# Altium schematic sheet drvinput2.SchDoc
size A4
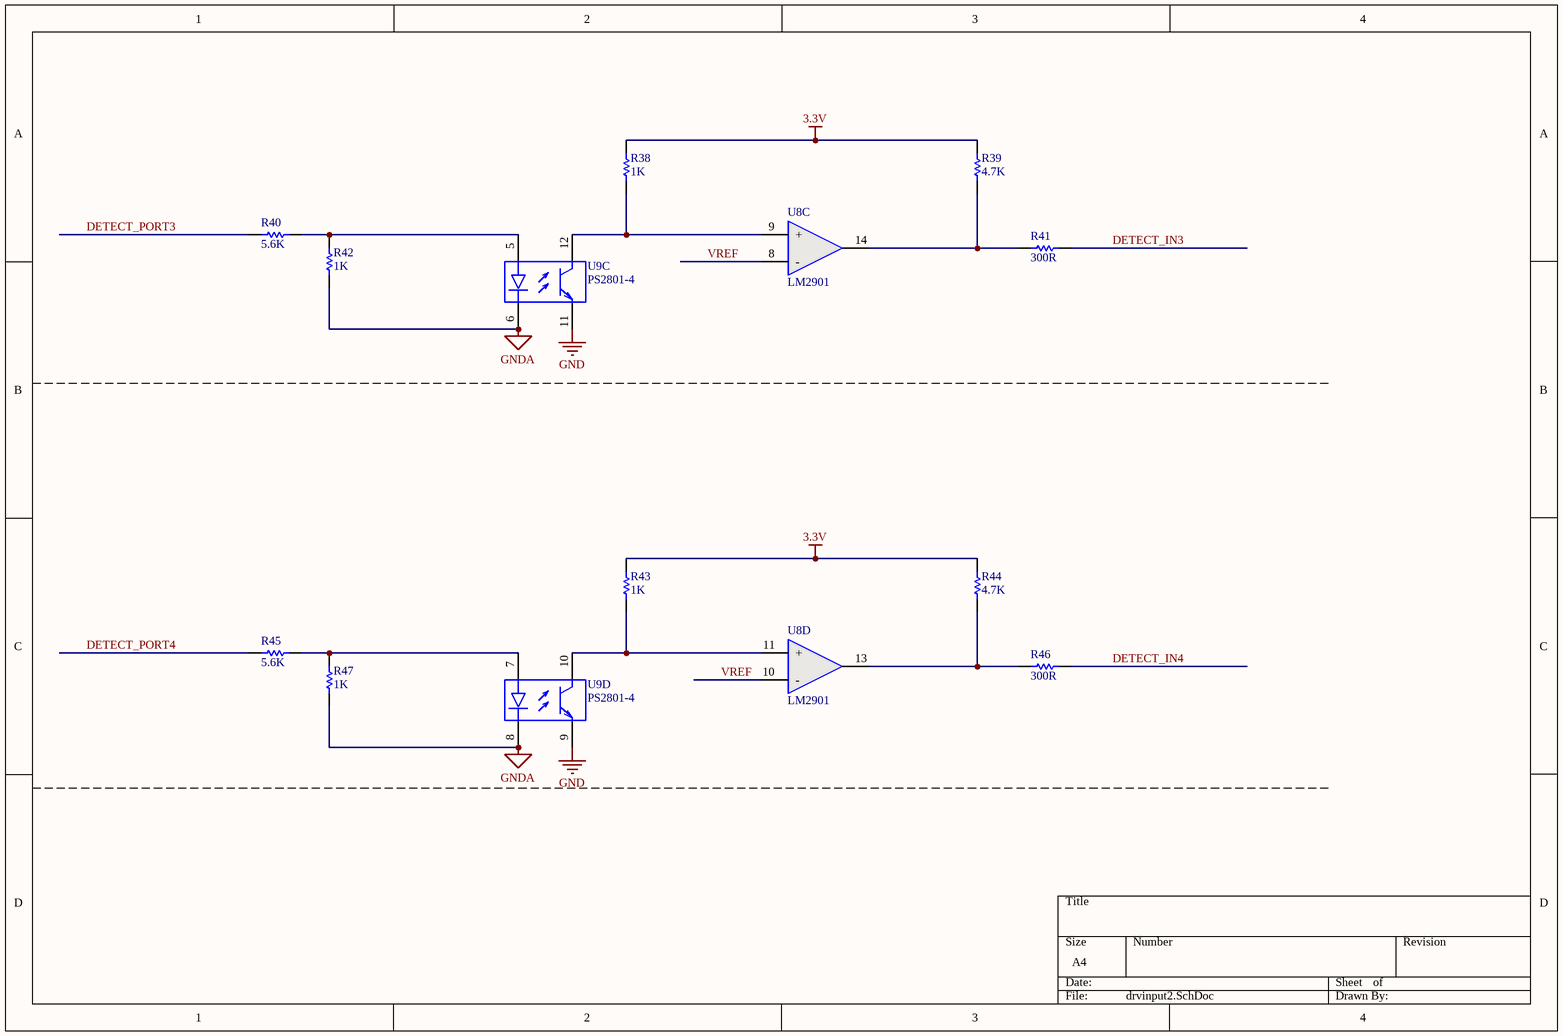
[diagram p0: drvinput2.SchDoc]

## Parts
R38  1K  [RESC2012M]
R39  4.7K  [RESC2012M]
R40  5.6K  [RESC2012M]
R41  300R  [RESC2012M]
R42  1K  [RESC2012M]
R43  1K  [RESC2012M]
R44  4.7K  [RESC2012M]
R45  5.6K  [RESC2012M]
R46  300R  [RESC2012M]
R47  1K  [RESC2012M]
U8  LM2901  [SOIC-14AM]  (parts C,D of 4)
U9  PS2801-4  [SOIC16_N]  (parts C,D of 4)

## Nets
3.3V: R38.1 R39.2 R43.1 R44.2
GND: U9.9(E) U9.11(E)
GNDA: R42.1 R47.1 U9.6(-) U9.8(-)
DETECT_IN3: R41.1
DETECT_IN4: R46.2
DETECT_PORT3: R40.2
DETECT_PORT4: R45.2
VREF: U8.8(-) U8.10(-)
NetR38_2: R38.2 U8.9(+) U9.12(C)
NetR39_1: R39.1 R41.2 U8.14(OUT)
NetR40_1: R40.1 R42.2 U9.5(+)
NetR43_2: R43.2 U8.11(+) U9.10(C)
NetR44_1: R44.1 R46.1 U8.13(OUT)
NetR45_1: R45.1 R47.2 U9.7(+)

## Library data of the parts
R38-R45 R47 = Res1: Resistor; Value: 10K; Published: 8-Jun-2000; LatestRevisionDate: 17-Jul-2002; LatestRevisionNote: Re-released for DXP Platform.; PackageReference: AXIAL-0.3; Publisher: Altium Limited
R46 = Res1: Resistor; Value: 470; Published: 8-Jun-2000; LatestRevisionDate: 17-Jul-2002; LatestRevisionNote: Re-released for DXP Platform.; PackageReference: AXIAL-0.3; Publisher: Altium Limited
U8 = LM2901: 4通道差分比较器芯片
U9 = PS2801-4: The PS2801-1 and PS2801-4 are optically coupled isolators containing a GaAs light emitting diode and an NPN  silicon phototransistor in a plastic SOP for high density applications.; Published: 28-Feb-2003; LatestRevisionDate: 13-Apr-2006; LatestRevisionNote: IPC-7351 Footprint Added.; DatasheetVersion: Jan-2002, Rev. 7; PackageVersion: rev7, Jan-2002; PackageReference: 751-07; Publisher: Altium Limited; PackageDescription: 8-Pin Plastic Small Outline Integrated Circuit 1.27 mm Pitch; Code_JEDEC: MS-012-AA; Code_IPC: SOIC127P600-8; ComponentLink1Description: Manufacturer Link; ComponentLink1URL: http://www.onsemi.com/; ComponentLink2Description: Datasheet; ComponentLink2URL: http://www.onsemi.com/pub/Collateral/LM358-D.PDF